# EAGLE design bitraf-rpi-breakout (EAGLE 6.4)
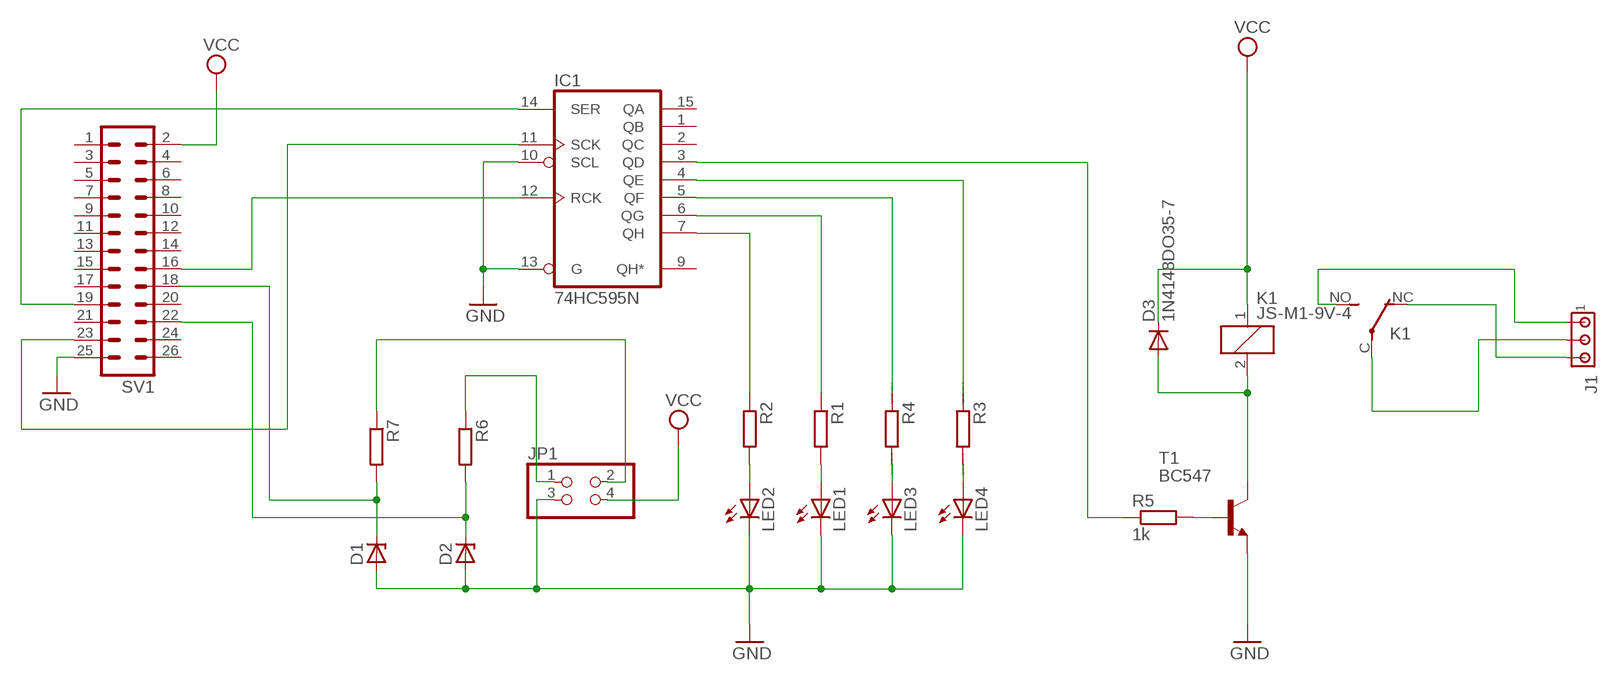
[diagram p0: schematic, sheet 1]

## Parts
D1  ZENER-DIODEZD-7.5  [ZDIO-7.5]
D2  ZENER-DIODEZD-7.5  [ZDIO-7.5]
D3  1N4148DO35-7  [DO35-7]
IC1  74HC595N  [DIL16]
J1  MTA03-156  [1X3MTA]
JP1  PINHD-2X2  [2X02]
K1  JS-M1-9V-4  [JS-M]
LED1  LED3MM  [LED3MM]
LED2  LED3MM  [LED3MM]
LED3  LEDSML1206  [SML1206]
LED4  LEDSML1206  [SML1206]
R1  R-EU_0204/7  [0204/7]
R2  R-EU_0204/7  [0204/7]
R3  RR1206  [R1206]
R4  RR1206  [R1206]
R5  1k  R-EU_0204/7  [0204/7]
R6  R-EU_0204/7  [0204/7]
R7  R-EU_0204/7  [0204/7]
SV1  ML26  [ML26]
T1  BC547  [TO92]

## Nets
GND: D1.A D2.A IC1.10(SCL) IC1.13(G) JP1.3 LED1.K(C) LED2.K(C) LED3.C LED4.C SV1.25 T1.1(E)
N$1: LED2.A R2.2
N$2: LED1.A R1.2
N$3: IC1.5(QF) R4.1
N$4: IC1.7(QH) R2.1
N$5: IC1.6(QG) R1.1
N$6: R5.2 T1.2(B)
N$7: IC1.3(QD) R5.1
N$8: D2.C R6.2 SV1.22
N$9: D1.C R7.2 SV1.18
N$12: IC1.4(QE) R3.1
N$13: LED3.A R4.2
N$14: LED4.A R3.2
N$15: D3.A K1.2 T1.3(C)
N$16 [power]: J1.2 K1.C(2:P)
N$17 [power]: J1.1 K1.NO(2:S)
N$18 [power]: J1.3 K1.NC(2:O)
N$19: IC1.12(RCK) SV1.16
N$20: IC1.11(SCK) SV1.23
N$21: IC1.14(SER) SV1.19
TTL_IN_1: JP1.2 R7.1
TTL_IN_2: JP1.1 R6.1
VCC: D3.C JP1.4 K1.1 SV1.2
Unconnected: IC1.1(QB) IC1.2(QC) IC1.9(QH*) IC1.15(QA) SV1.1 SV1.3 SV1.4 SV1.5 SV1.6 SV1.7 SV1.8 SV1.9 SV1.10 SV1.11 SV1.12 SV1.13 SV1.14 SV1.15 SV1.17 SV1.20 SV1.21 SV1.24 SV1.26

## Power pins joined to a net without a drawn wire
GND: IC1.8(GND)
VCC: IC1.16(VCC)

## Library data of the parts
D1 D2 = diode:ZENER-DIODE: Z-Diode
D3 = diode:1N4148: DIODE high speed (Philips)
IC1 = 74xx-eu:74*595: 8-bit SHIFT REGISTER, output latch
J1 = con-amp:MTA03-156: AMP connector
JP1 = pinhead:PINHD-2X2: PIN HEADER
K1 = relay:JS-M1*: Automotive Ultra-Miniature Power Relay NAiS Source: http://www.mew-europe.com/.. en_ds_61211_0000.pdf; OC_FARNELL: unknown; OC_NEWARK: unknown
LED1-LED4 = led:LED: LED OSRAM: - CHIPLED LG R971, LG N971, LY N971, LG Q971, LY Q971, LO R971, LY R971 LH N974, LH R974 LS Q976, LO Q976, LY Q976 LO Q996 - Hyper CHIPLED LW Q18S LB Q993, LB Q99A, LB R99A - SideLED LS A670, LO A670, LY A670, LG A670, LP A670 LB A673, LV A673, LT A673, LW A673 LH A674 LY A675 LS A676, LA A676, LO A676, LY A676, LW A676 LS A679, LY A679, LG A679 - Hyper Micro SIDELED® LS Y876, LA Y876, LO Y876, LY Y876 LT Y87S - SmartLED LW L88C, LW L88S LB L89C, LB L89S, LG L890 LS L89K, LO L89K, LY L89K LS L896, LA L896, LO L896, LY L896 - TOPLED LS T670, LO T670, LY T670, LG T670, LP T670 LSG T670, LSP T670, LSY T670, LOP T670, LYG T670 LG T671, LOG T671, LSG T671 LB T673, LV T673, LT T673, LW T673 LH T674 LS T676, LA T676, LO T676, LY T676, LB T676, LH T676, LSB T676, LW T676 LB T67C, LV T67C, LT T67C, LS T67K, LO T67K, LY T67K, LW E67C LS E67B, LA E67B, LO E67B, LY E67B, LB E67C, LV E67C, LT E67C LW T67C LS T679, LY T679, LG T679 LS T770, LO T770, LY T770, LG T770, LP T770 LB T773, LV T773, LT T773, LW T773 LH T774 LS E675, LA E675, LY E675, LS T675 LS T776, LA T776, LO T776, LY T776, LB T776 LHGB T686 LT T68C, LB T68C - Hyper Mini TOPLED® LB M676 - Mini TOPLED Santana® LG M470 LS M47K, LO M47K, LY M47K Source: http://www.osram.convergy.de LUXEON: - LUMILED® LXK2-PW12-R00, LXK2-PW12-S00, LXK2-PW14-U00, LXK2-PW14-V00 LXK2-PM12-R00, LXK2-PM12-S00, LXK2-PM14-U00 LXK2-PE12-Q00, LXK2-PE12-R00, LXK2-PE12-S00, LXK2-PE14-T00, LXK2-PE14-U00 LXK2-PB12-K00, LXK2-PB12-L00, LXK2-PB12-M00, LXK2-PB14-N00, LXK2-PB14-P00, LXK2-PB14-Q00 LXK2-PR12-L00, LXK2-PR12-M00, LXK2-PR14-Q00, LXK2-PR14-R00 LXK2-PD12-Q00, LXK2-PD12-R00, LXK2-PD12-S00 LXK2-PH12-R00, LXK2-PH12-S00 LXK2-PL12-P00, LXK2-PL12-Q00, LXK2-PL12-R00 Source: www.luxeon.com KINGBRIGHT: KA-3528ASYC Source: www.kingbright.com
R1 R2 R5-R7 = resistor:R-EU_: RESISTOR, European symbol
R3 R4 = eagle-ltspice:R: RESISTOR, European symbol; SPICEMODEL: NONE; SPICEPREFIX: R
SV1 = con-ml:ML26: HARTING; OC_FARNELL: unknown; OC_NEWARK: unknown
T1 = transistor:BC547: NPN TRANSISTOR

## Net classes
0 default: clearance 0.355 mm
1 power: width 1 mm

## Board
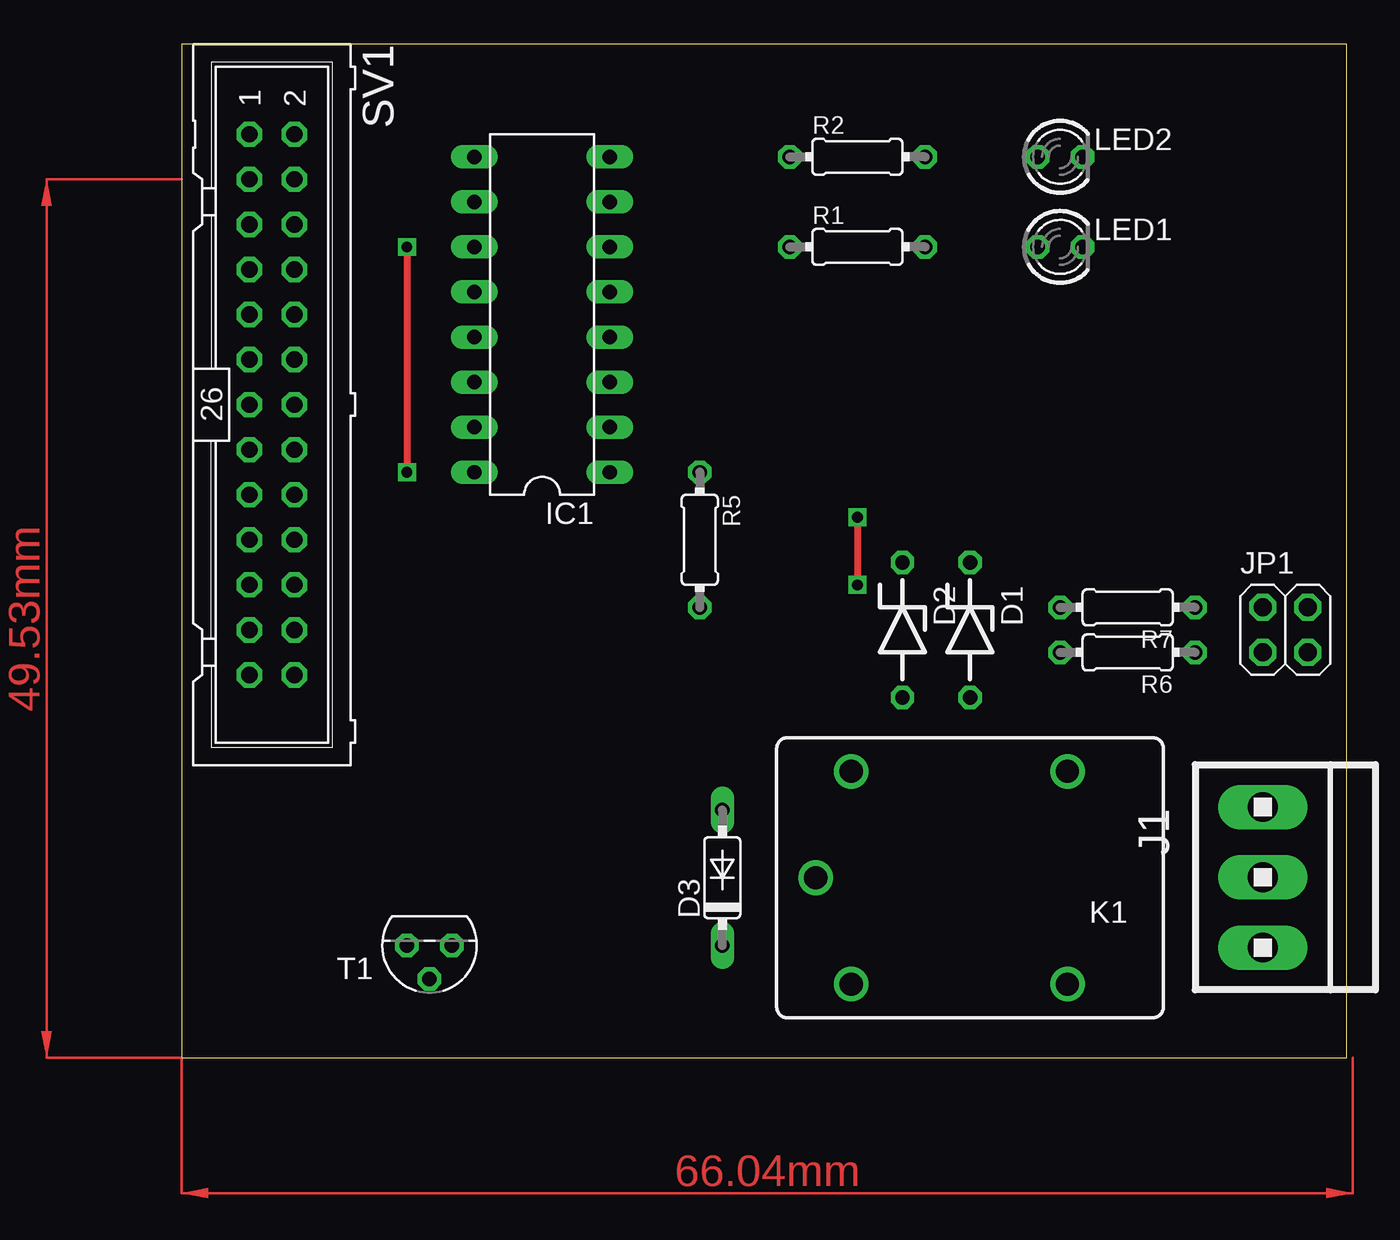
[diagram p1: board, top side]
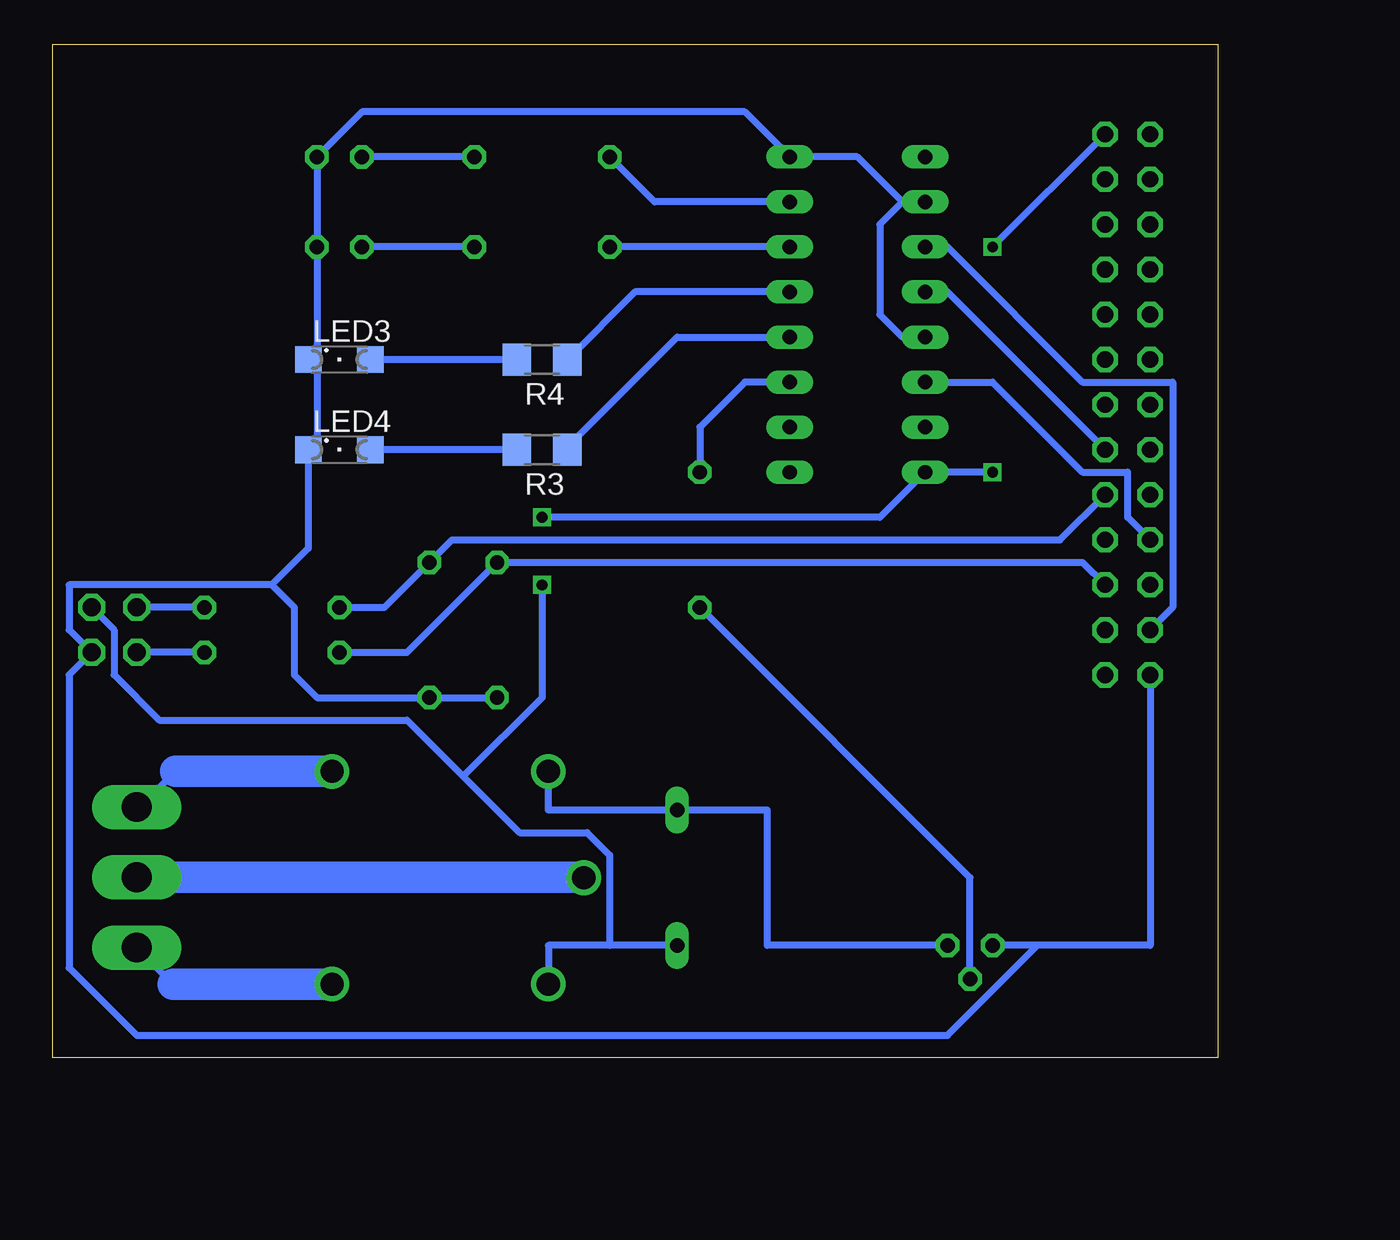
[diagram p2: board, bottom side, seen from below]

Size 65.71 x 57.14 mm. Coordinates in mm from the lower left corner, seen from the top.
Outline: 0,0 65.71,0 65.71,57.14 0,57.14 0,0
Copper layers (1*16): Top 0.035mm / dielectric 1.5mm / Bottom 0.035mm
Design rules "bitraf-rpi-breakout": minimum track width 10mil, minimum drill 24mil, track to track 0.355mm, track to pad 0.355mm, pad to pad 0.355mm, via to via 0.355mm, smd to smd 8mil, copper to edge 40mil, drill to drill 8mil, minimum pad ring 10mil, minimum via ring 8mil, stop-mask expansion 4mil, vias tented up to drill 0mil, thermal gap 10mil

### Footprints (pad centres in the part's own frame; a part is rotated, then mirrored left to right if it is on the bottom)
ZDIO-7.5 = drill 0.813 octagon: A 3.81,0; C -3.81,0
DO35-7 = drill 0.813 long: A 3.81,0; C -3.81,0
DIL16 = drill 0.813 long: 1 -8.89,-3.81; 2 -6.35,-3.81; 3 -3.81,-3.81; 4 -1.27,-3.81; 5 1.27,-3.81; 6 3.81,-3.81; 7 6.35,-3.81; 8 8.89,-3.81; 9 8.89,3.81; 10 6.35,3.81; 11 3.81,3.81; 12 1.27,3.81; 13 -1.27,3.81; 14 -3.81,3.81; 15 -6.35,3.81; 16 -8.89,3.81
1X3MTA = drill 1.676 long: 1 3.937,0; 2 -0.025,0; 3 -3.988,0
2X02 = drill 1.016 octagon: 1 -1.27,-1.27; 2 -1.27,1.27; 3 1.27,-1.27; 4 1.27,1.27
JS-M = drill 1.3: 1 6.7,6; 2 6.7,-6; C 8.7,0; NC -5.5,-6; NO -5.5,6
LED3MM = drill 0.813 octagon: A -1.27,0; K 1.27,0
SML1206 = smd 1.5 x 1.5: A 1.75,0; C -1.75,0
0204/7 = drill 0.813 octagon: 1 -3.81,0; 2 3.81,0
R1206 = smd 1.6 x 1.803: 1 -1.422,0; 2 1.422,0
ML26 = drill 0.914 octagon: 1 -15.24,-1.27; 2 -15.24,1.27; 3 -12.7,-1.27; 4 -12.7,1.27; 5 -10.16,-1.27; 6 -10.16,1.27; 7 -7.62,-1.27; 8 -7.62,1.27; 9 -5.08,-1.27; 10 -5.08,1.27; 11 -2.54,-1.27; 12 -2.54,1.27; 13 0,-1.27; 14 0,1.27; 15 2.54,-1.27; 16 2.54,1.27; 17 5.08,-1.27; 18 5.08,1.27; 19 7.62,-1.27; 20 7.62,1.27; 21 10.16,-1.27; 22 10.16,1.27; 23 12.7,-1.27; 24 12.7,1.27; 25 15.24,-1.27; 26 15.24,1.27
TO92 = drill 0.813 octagon: 1 1.27,0; 2 0,1.905; 3 -1.27,0

### Placement (x,y rotation side)
D1  44.45,24.13 270 top
D2  40.64,24.13 270 top
D3  30.48,10.16 90 top
IC1  20.32,41.91 90 top
J1  60.96,10.16 270 top
JP1  62.23,24.13 0 top
K1  44.45,10.16 180 top
LED1  49.53,45.72 0 top
LED2  49.53,50.8 0 top
LED3  49.53,39.37 0 bottom
LED4  49.53,34.29 0 bottom
R1  38.1,45.72 0 top
R2  38.1,50.8 0 top
R3  38.1,34.29 180 bottom
R4  38.1,39.37 180 bottom
R5  29.21,29.21 270 top
R6  53.34,22.86 180 top
R7  53.34,25.4 180 top
SV1  5.08,36.83 270 top
T1  13.97,6.35 180 top

### Tracks (layer width: path | path; a pad name or v marks a point on that pad's centre or on a via)
GND
  Bottom 0.406: SV1.25 3.81,6.35 10.16,6.35 | 10.16,6.35 T1.1 | 50.8,39.37 LED1.K LED2.K 48.26,53.34 26.67,53.34 IC1.8 20.32,50.8 17.78,48.26 | LED3.C 50.8,39.37 | 50.8,39.37 50.8,34.29 LED4.C 51.28,28.73 53.34,26.67 | IC1.10 17.78,48.26 | 17.78,48.26 19.05,46.99 19.05,41.91 17.78,40.64 IC1.13 | 53.34,26.67 52.07,25.4 52.07,21.59 50.8,20.32 D2.A D1.A | 53.34,26.67 64.77,26.67 64.77,24.13 JP1.3 64.77,21.59 64.77,5.08 60.96,1.27 15.24,1.27 10.16,6.35
N$1
  Bottom 0.406: R2.2 LED2.A
N$2
  Bottom 0.406: R1.2 LED1.A
N$3
  Bottom 0.406: IC1.5 32.87,43.18 R4.1
N$4
  Bottom 0.406: IC1.7 31.75,48.26 R2.1
N$5
  Bottom 0.406: IC1.6 R1.1
N$6
  Bottom 0.406: T1.2 13.97,10.16 R5.2
N$7
  Bottom 0.406: IC1.3 26.67,38.1 29.21,35.56 R5.1
N$8
  Bottom 0.406: R6.2 45.72,22.86 D2.C 7.62,27.94 SV1.22
N$9
  Bottom 0.406: R7.2 46.99,25.4 D1.C 43.18,29.21 8.89,29.21 SV1.18
N$12
  Bottom 0.406: R3.1 36.68,34.44 30.48,40.64 IC1.4
N$13
  Bottom 0.406: R4.2 LED3.A
N$14
  Bottom 0.406: R3.2 LED4.A
N$15
  Bottom 0.406: K1.2 37.75,13.97 D3.A 25.4,13.97 25.4,6.35 T1.3
N$16
  Bottom 0.406: 35.77,10.19 K1.C
  Bottom 1.778: J1.2 35.77,10.19
N$17
  Bottom 0.406: 58.9,4.16 J1.1
  Bottom 1.778: K1.NO 58.9,4.16
N$18
  Bottom 0.406: 58.77,16.16 60.96,13.97 J1.3
  Bottom 1.778: K1.NC 58.77,16.16
N$19
  Bottom 0.406: SV1.16 15.24,43.18 IC1.12
N$20
  Bottom 0.406: IC1.11 15.24,45.72 7.62,38.1 2.54,38.1 2.54,25.4 SV1.23
N$21
  Bottom 0.406: SV1.19 5.08,30.48 5.08,33.02 7.62,33.02 12.7,38.1 IC1.14
TTL_IN_1
  Bottom 0.406: R7.1 JP1.2
TTL_IN_2
  Bottom 0.406: R6.1 JP1.1
VCC  (via drill 0.6)
  Top 0.406: v12.7,45.72 v12.7,33.02 | v38.1,30.48 v38.1,26.67
  Bottom 0.406: D3.C 34.29,6.35 | 34.29,6.35 37.75,6.35 K1.1 | 42.55,15.88 45.72,19.05 59.69,19.05 62.23,21.59 62.23,24.13 JP1.4 | 42.55,15.88 39.37,12.7 35.56,12.7 34.29,11.43 34.29,6.35 | SV1.2 v12.7,45.72 | v12.7,33.02 IC1.16 19.05,30.48 v38.1,30.48 | v38.1,26.67 38.1,20.32 42.55,15.88
(copper drawn outside any net)
  shapes: Top area x2